# Altium project Adult_Main_Power_Unit.PrjPcb
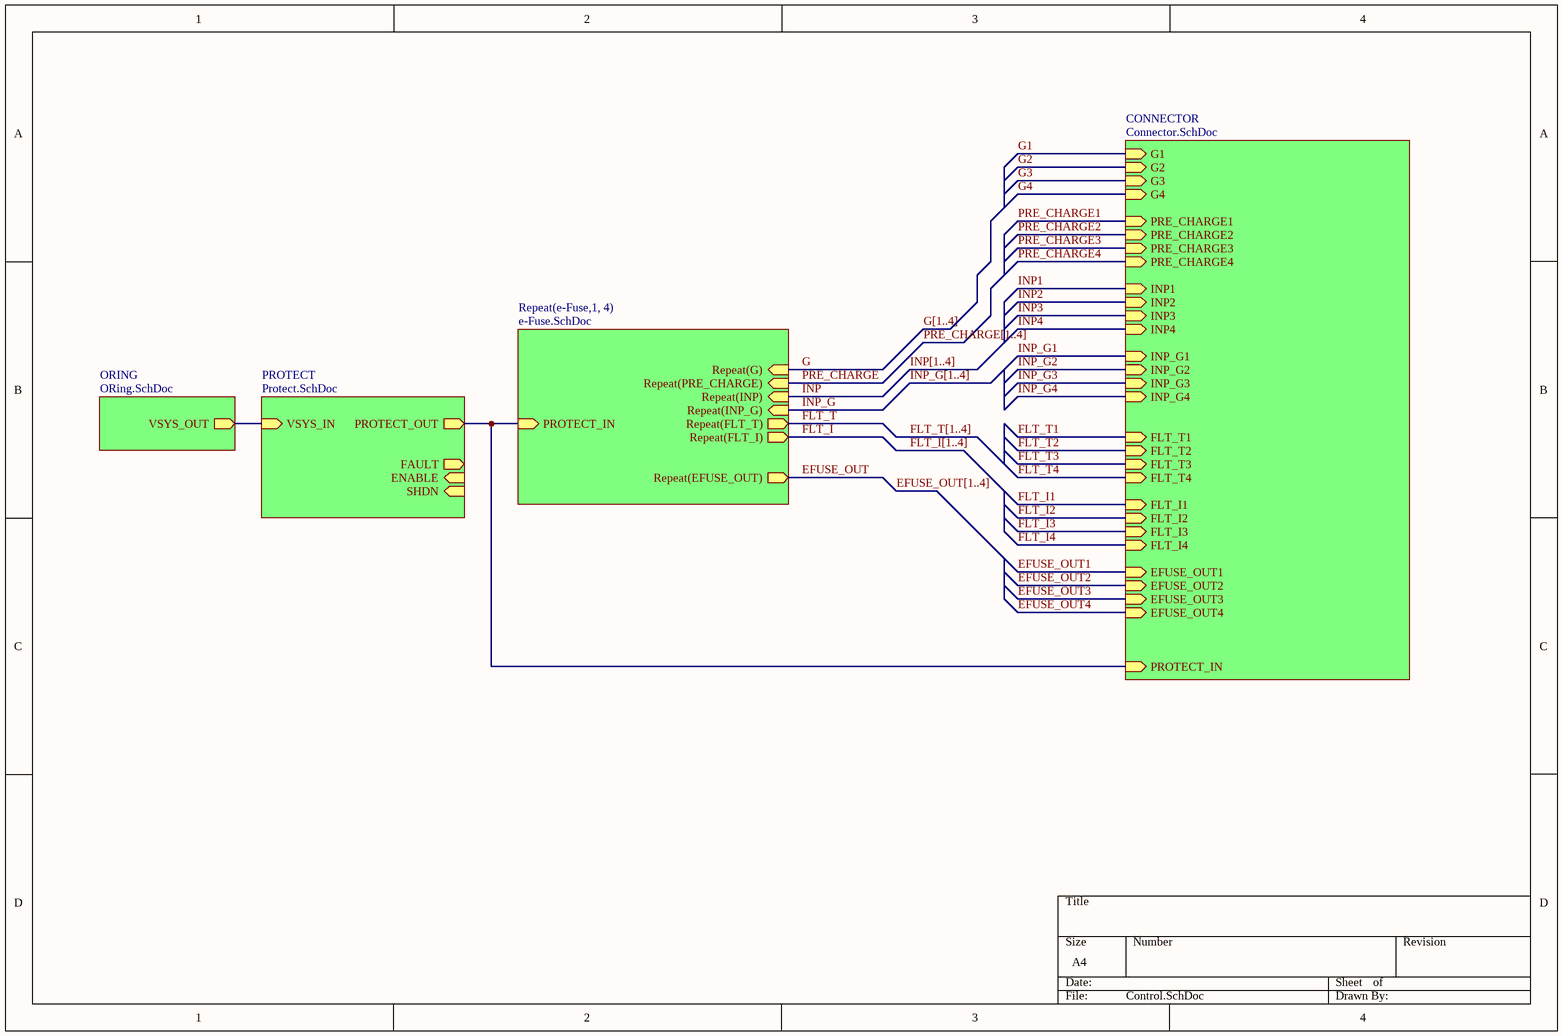
[diagram p0: Control.SchDoc]
5 sheets, 173 parts. Net scope: hierarchical (ports join the sheet entries above them; power ports are global).
Board file: Main_Power_Uint_1st.PcbDoc
Sheets:
  Control.SchDoc
    PROTECT = Protect.SchDoc
    e-Fuse1 = e-Fuse.SchDoc
    e-Fuse2 = e-Fuse.SchDoc
    e-Fuse3 = e-Fuse.SchDoc
    e-Fuse4 = e-Fuse.SchDoc
    CONNECTOR = Connector.SchDoc
    ORING = ORing.SchDoc

## Sheet Control.SchDoc
size A4; SheetNumber: 1; SheetTotal: 5

### Sub-sheets
CONNECTOR = Connector.SchDoc: FLT_I4 (in), FLT_T4 (in), INP_G4 (in), INP4 (in), FLT_I3 (in), FLT_T3 (in), INP_G3 (in), INP3 (in), FLT_I2 (in), FLT_T2 (in), INP_G2 (in), INP2 (in), FLT_I1 (in), FLT_T1 (in), INP_G1 (in), INP1 (in), PROTECT_IN (in), EFUSE_OUT4 (in), EFUSE_OUT3 (in), EFUSE_OUT2 (in), EFUSE_OUT1 (in), PRE_CHARGE4 (in), G4 (in), G3 (in), PRE_CHARGE2 (in), G2 (in), PRE_CHARGE1 (in), G1 (in), PRE_CHARGE3 (in)
ORING = ORing.SchDoc: VSYS_OUT (out)
PROTECT = Protect.SchDoc: PROTECT_OUT (out), VSYS_IN (in), SHDN (in), ENABLE (in), FAULT (out)
Repeat(e-Fuse,1, 4) = e-Fuse.SchDoc: PROTECT_IN (in), Repeat(PRE_CHARGE) (in), Repeat(EFUSE_OUT) (out), Repeat(G) (in), Repeat(FLT_I) (out), Repeat(FLT_T) (out), Repeat(INP_G) (in), Repeat(INP) (in)

### Nets
OUT1: sheet PROTECT/VSYS_IN, sheet ORING/VSYS_OUT
EFUSE_OUT: sheet Repeat(e-Fuse,1, 4)/Repeat(EFUSE_OUT)
FLT_I: sheet Repeat(e-Fuse,1, 4)/Repeat(FLT_I)
FLT_T: sheet Repeat(e-Fuse,1, 4)/Repeat(FLT_T)
G: sheet Repeat(e-Fuse,1, 4)/Repeat(G)
I_SENSE_N: sheet PROTECT/PROTECT_OUT, sheet Repeat(e-Fuse,1, 4)/PROTECT_IN, sheet CONNECTOR/PROTECT_IN
INP: sheet Repeat(e-Fuse,1, 4)/Repeat(INP)
INP_G: sheet Repeat(e-Fuse,1, 4)/Repeat(INP_G)
PRE_CHARGE: sheet Repeat(e-Fuse,1, 4)/Repeat(PRE_CHARGE)

### Buses and harness runs
bus EFUSE_OUT[1..4]
bus FLT_I[1..4]
bus FLT_T[1..4]
bus G[1..4]
bus INP[1..4]
bus INP_G[1..4]
bus PRE_CHARGE[1..4]

## Sheet Protect.SchDoc
size A3; SheetNumber: 3; SheetTotal: 5
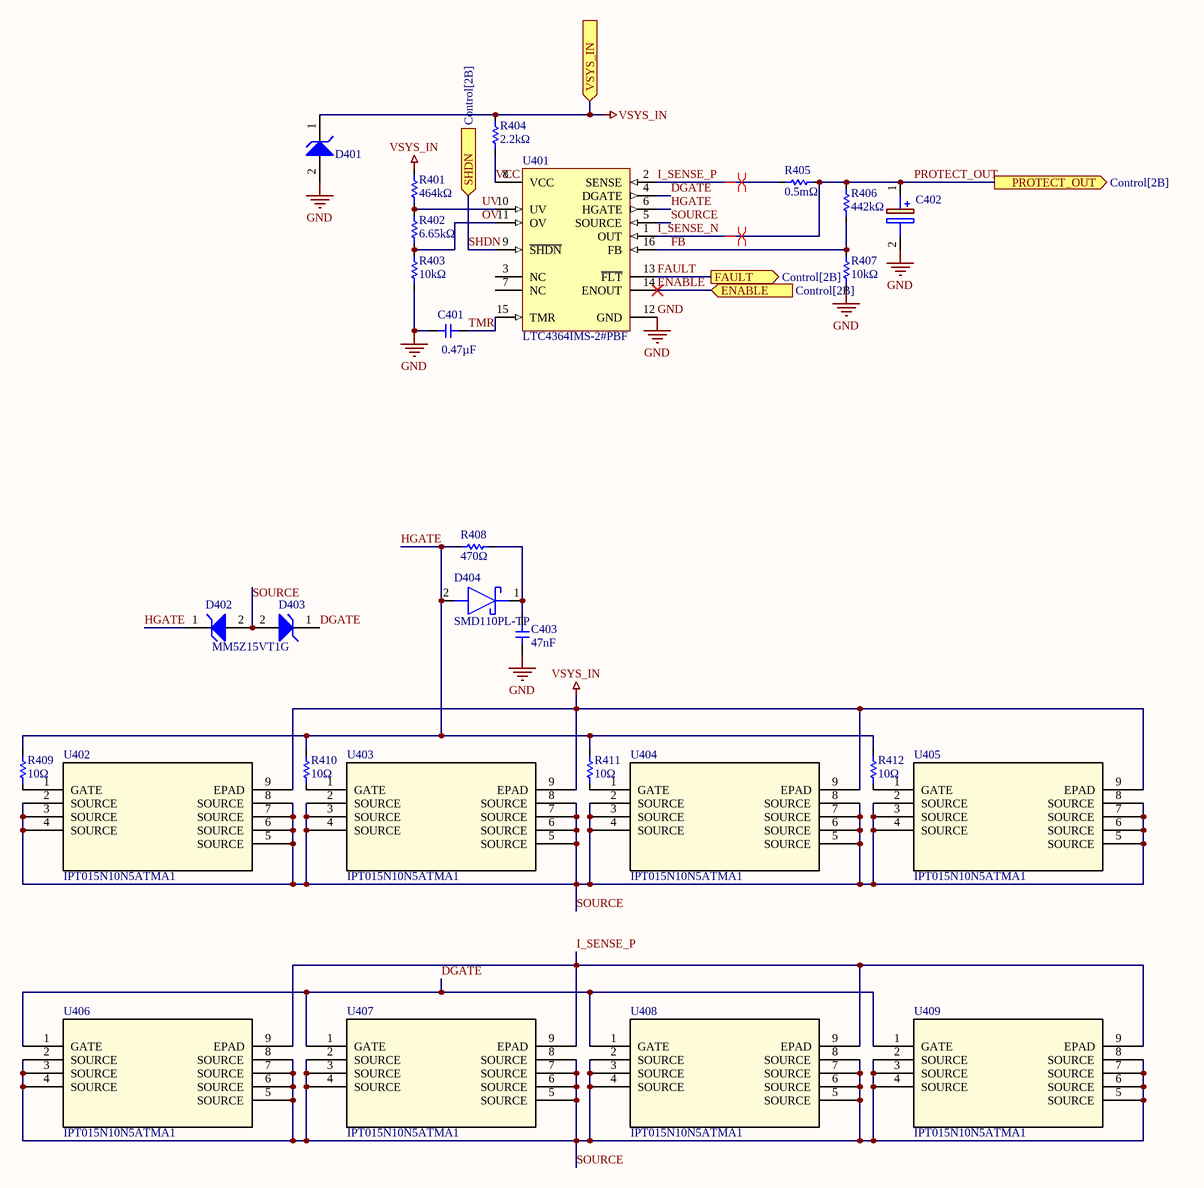
[diagram p1: Protect.SchDoc]

### Parts
C401  Capacitance: 0.47µF  [1210]  (hidden comment: non-polar_Capacitor)
C402  B41858C9477M000  [CAPPRD750W90D1800H3700]  (value not drawn)
C403  Capacitance: 47nF  [1210]  (hidden comment: non-polar_Capacitor)
D401  1SMB5945BT3G  [ONSC-SMB-2-403A-03_H_V]  (value not drawn)
D402  MM5Z15VT1G  [ONSC-SOD-523-2-502-01_V]
D403  MM5Z15VT1G  [ONSC-SOD-523-2-502-01_V]  (value not drawn)
D404  SMD110PL-TP  [SODFL3616X135N]
R401  464kΩ  [SMD_0603]
R402  6.65kΩ  [SMD_0603]
R403  10kΩ  [SMD_0603]
R404  2.2kΩ  [SMD_2512]
R405  0.5mΩ  [SMD_2512]
R406  442kΩ  [SMD_0603]
R407  10kΩ  [SMD_0603]
R408  470Ω  [SMD_0603]
R409  10Ω  [SMD_0603]
R410  10Ω  [SMD_0603]
R411  10Ω  [SMD_0603]
R412  10Ω  [SMD_0603]
U401  LTC4364IMS-2#PBF  [LT-MS-16_M]
U402  IPT015N10N5ATMA1  [PG-HSOF-8-1_INF]
U403  IPT015N10N5ATMA1  [PG-HSOF-8-1_INF]
U404  IPT015N10N5ATMA1  [PG-HSOF-8-1_INF]
U405  IPT015N10N5ATMA1  [PG-HSOF-8-1_INF]
U406  IPT015N10N5ATMA1  [PG-HSOF-8-1_INF]
U407  IPT015N10N5ATMA1  [PG-HSOF-8-1_INF]
U408  IPT015N10N5ATMA1  [PG-HSOF-8-1_INF]
U409  IPT015N10N5ATMA1  [PG-HSOF-8-1_INF]

### Ports
ENABLE (in, see Control[2B]), FAULT (out, see Control[2B]), PROTECT_OUT (out, see Control[2B]), SHDN (in, see Control[2B]), VSYS_IN (in, see Control[1B])

### Nets
GND: C401.1 C402.2(-) C403.1 D401.2(A) R403.2 R407.2 U401.12(GND)
VSYS_IN: D401.1(K) R401.1 R404.1 U402.9(EPAD) U403.9(EPAD) U404.9(EPAD) U405.9(EPAD) ; port VSYS_IN  [project net OUT1]
DGATE: D403.1(K) U401.4(DGATE) U406.1(GATE) U407.1(GATE) U408.1(GATE) U409.1(GATE)
ENABLE: U401.14(ENOUT) ; port ENABLE
FAULT: U401.13(~{FLT}) ; port FAULT
FB: R406.2 R407.1 U401.16(FB)
HGATE: D402.1(K) D404.2(A) R408.1 R409.1 R410.1 R411.1 R412.1 U401.6(HGATE)
I_SENSE_N: C402.1(+) R405.2 R406.1 U401.1(OUT) ; port PROTECT_OUT  [also labelled PROTECT_OUT]
I_SENSE_P: R405.1 U401.2(SENSE) U406.9(EPAD) U407.9(EPAD) U408.9(EPAD) U409.9(EPAD)
OV: R402.2 R403.1 U401.11(OV)
SHDN: U401.9(~{SHDN}) ; port SHDN
SOURCE: D402.2(A) D403.2(A) U401.5(SOURCE) U402.2(SOURCE) U402.3(SOURCE) U402.4(SOURCE) U402.5(SOURCE) U402.6(SOURCE) U402.7(SOURCE) U402.8(SOURCE) U403.2(SOURCE) U403.3(SOURCE) U403.4(SOURCE) U403.5(SOURCE) U403.6(SOURCE) U403.7(SOURCE) U403.8(SOURCE) U404.2(SOURCE) U404.3(SOURCE) U404.4(SOURCE) U404.5(SOURCE) U404.6(SOURCE) U404.7(SOURCE) U404.8(SOURCE) U405.2(SOURCE) U405.3(SOURCE) U405.4(SOURCE) U405.5(SOURCE) U405.6(SOURCE) U405.7(SOURCE) U405.8(SOURCE) U406.2(SOURCE) U406.3(SOURCE) U406.4(SOURCE) U406.5(SOURCE) U406.6(SOURCE) U406.7(SOURCE) U406.8(SOURCE) U407.2(SOURCE) U407.3(SOURCE) U407.4(SOURCE) U407.5(SOURCE) U407.6(SOURCE) U407.7(SOURCE) U407.8(SOURCE) U408.2(SOURCE) U408.3(SOURCE) U408.4(SOURCE) U408.5(SOURCE) U408.6(SOURCE) U408.7(SOURCE) U408.8(SOURCE) U409.2(SOURCE) U409.3(SOURCE) U409.4(SOURCE) U409.5(SOURCE) U409.6(SOURCE) U409.7(SOURCE) U409.8(SOURCE)
TMR: C401.2 U401.15(TMR)
UV: R401.2 R402.1 U401.10(UV)
VCC: R404.2 U401.8(VCC)
NetC403_2: C403.2 D404.1(K) R408.2
NetR409_2: R409.2 U402.1(GATE)
NetR410_2: R410.2 U403.1(GATE)
NetR411_2: R411.2 U404.1(GATE)
NetR412_2: R412.2 U405.1(GATE)

Not connected (* = marked no-connect by the designer): U401 3(NC) 7(NC)

### Layout directives
differential pair: I_SENSE_N, I_SENSE_P

### Library data of the parts
C401 C403 = CMP-024-000020-15: SMD type ceramic capacitor; Voltage: 50V; Design Item ID: Capacitor; Source: robit_passive.SchLib
C402 = B41858C9477M000: Capacitor Polarised; Manufacturer_Name: TDK; Datasheet Link: https://product.tdk.com/system/files/dam/doc/product/capacitor/aluminum-electrolytic/single-ended/data_sheet/20/30/db/aec/b41858.pdf; Height: 37mm; Manufacturer_Part_Number: B41858C9477M000; Mouser Part Number: 871-B41858C9477M; Mouser Price/Stock: https://www.mouser.co.uk/ProductDetail/EPCOS-TDK/B41858C9477M000?qs=nadT%2FcWsIvCTpIhXZMST%2FQ%3D%3D
D401 = CMP-1060-00175-1: 3 W Zener Voltage Regulator, 2-Pin SMB, Pb-Free, Tape and Reel; Manufacturer: On Semiconductor; VZ Typ (V): 68; ComponentLink3URL: http://www.onsemi.com/pub_link/Collateral/1SMB5913BT3-D.PDF; PackageReference: SMB-2-403A-03_H; PackageDescription: 2-Pin Small Molded Package, J-Bend Lead, Body 4.33 x 3.625 mm; PackageVersion: Rev. H, 05/2011; PartNumber: 1SMB5945BT3G; DatasheetVersion: Rev. 8; ComponentLink1Description: Manufacturer URL; ComponentLink1URL: http://www.onsemi.com/; RoHS: Pb-Free; ComponentLink2Description: Datasheet; Packing: Tape and Reel; ComponentLink2URL: http://www.onsemi.com/pub_link/Collateral/1SMB5913BT3-D.PDF; ComponentLink3Description: Package Specification; Mounting Technology: Surface Mount
D402 D403 = CMP-1060-00793-1: Zener Voltage Regulator, 500 mW, 2-Pin SOD-523, Pb-Free, Tape and Reel; Manufacturer: On Semiconductor; VZ Typ (V): 15; P Max (W): 0.5; PackageVersion: Rev. E, 09/2010; PartNumber: MM5Z15VT1G; ComponentLink2URL: http://www.onsemi.cn/pub_link/Collateral/MM5Z2V4T1-D.PDF; ComponentLink2Description: Datasheet; ComponentLink1Description: Manufacturer URL; PackageReference: SOD-523-2-502-01; ComponentLink3URL: http://www.onsemi.com/pub_link/Collateral/502-01.PDF; PackageDescription: 2-Pin SOD, Body 1.2 x 0.8 mm; ComponentLink3Description: Package Specification; RoHS: Pb-Free; ComponentLink1URL: http://www.onsemi.com/; Mounting Technology: Surface Mount; Packing: Tape and Reel; DatasheetVersion: Rev. 10
D404 = SMD110PL-TP: Schottky Diode; Manufacturer_Name: MCC; Datasheet Link: https://www.mccsemi.com/pdf/Products/SMD15PL-SMD1200PL(SOD-123FL).pdf; Height: 1.35mm; Manufacturer_Part_Number: SMD110PL-TP; Mouser Part Number: 833-SMD110PL-TP; Mouser Price/Stock: https://www.mouser.co.uk/ProductDetail/Micro-Commercial-Components-MCC/SMD110PL-TP?qs=xjxbgUsuSIBtRX%252BtbqnRwQ%3D%3D; Arrow Part Number: SMD110PL-TP; Arrow Price/Stock: https://www.arrow.com/en/products/smd110pl-tp/micro-commercial-components?utm_currency=USD&region=europe
R401-R407 R409-R412 = Resistor
R408 = Resistor: 0.1W, 0603
U401 = CMP-0474-00539-1: Surge Stopper with Ideal Diode, 4 to 80 V Vin, 16-pin SOP (MS-16), -40 to 85 degC, Pb-Free; Manufacturer: Linear Technology; Fast Comparator: no; Circuit Breaker Threshold: 50 mV; Circuit Breakers(#): 1; Active Limiting: yes; Vin Range: 4 to 80 V; Circuit Breaker Accuracy(%): 10; Extended Temp: C, I, H; ComponentLink1Description: Manufacturer URL; PackageReference: MS16; Mounting Technology: Surface Mount; RoHS: TRUE; PackageDescription: 16-Pin Plastic MSOP, Body 4.04 x 3.00 mm, Pitch 0.50 mm; ComponentLink3Description: Package Specification; PartNumber: LTC4364IMS-2#PBF; Power Good: no; ComponentLink2Description: Datasheet; ComponentLink2URL: http://cds.linear.com/docs/en/datasheet/436412f.pdf; ComponentLink1URL: http://www.linear.com/; ComponentLink3URL: http://cds.linear.com/docs/en/packaging/05081669_A_MS16.pdf; PackageVersion: Rev. Ã˜, 06/2010
U402-U409 = IPT015N10N5ATMA1: Infineonâ€™s OptiMOSâ„¢ power MOSFET in TO-Leadless package is optimized for high current applications up to 300 A, such as forklifts, light electric vehicles (LEV), power tools, point-of-loads (POL), telecom and e-fuses. Furthermore, the 60 percent smaller package size enables a very compact design. Compared to DÂ²PAK 7-pin, TO-Leadless shows a substantial reduction in footprint of 30 percent. The 50 percent reduced height offers a significant advantage in narrow applications such as rack or blade servers.; Copyright: Copyright (C) 2025 Ultra Librarian. All rights reserved.; Manufacturer_Name: Infineon; Manufacturer_Part_Number: IPT015N10N5ATMA1; RefDes: RefDes; Type: Type

## Sheet e-Fuse.SchDoc
size A3; SheetNumber: 4; SheetTotal: 5
Used 4 times, as channels e-Fuse1, e-Fuse2, e-Fuse3, e-Fuse4. Parts and nets are listed once, with the designators drawn on the sheet.
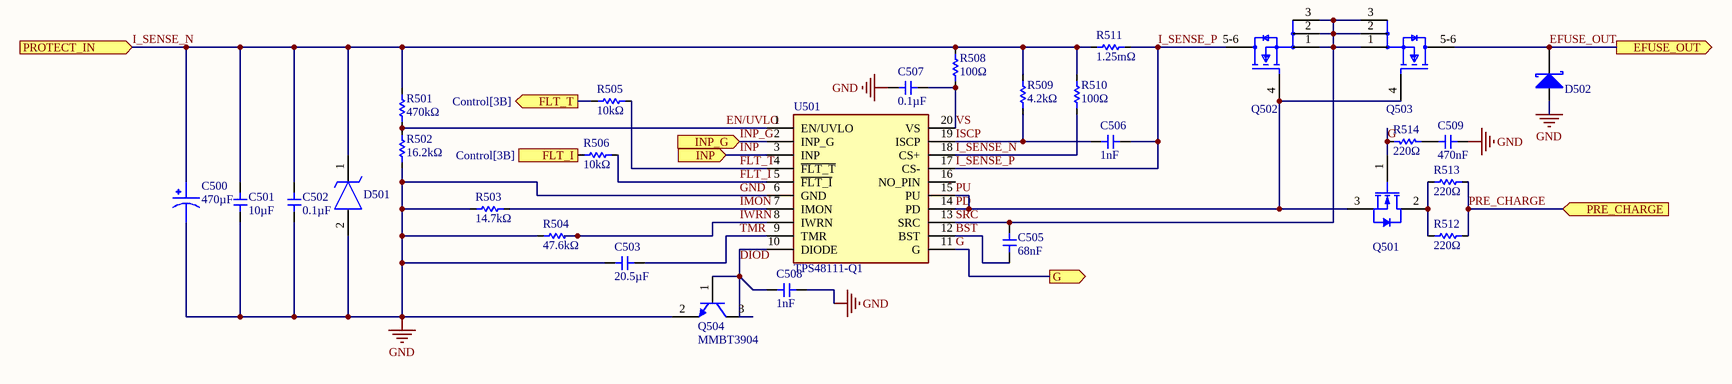
[diagram p2: e-Fuse.SchDoc]

### Parts
C500  470µF  [CAPAE1900X2200N]
C501  Capacitance: 10µF  [0603]  (hidden comment: CIN)
C502  Capacitance: 0.1µF  [0603]  (hidden comment: CIN)
C503  Capacitance: 20.5µF  [1210]  (hidden comment: C(TMR))
C505  Capacitance: 68nF  [0603]  (hidden comment: CBST)
C506  Capacitance: 1nF  [0603]  (hidden comment: C(SCP))
C507  Capacitance: 0.1µF  [0603]  (hidden comment: C(TMR))
C508  Capacitance: 1nF  [1210]  (hidden comment: C(TMR))
C509  Capacitance: 470nF  [0603]  (hidden comment: C(TMR))
D501  SMLJ58AQ-TP  [DIOM7959X282N]  (value not drawn)
D502  DFLS1100-7  [DIOD-POWERDI123-2_V]  (value not drawn)
Q501  IPD068N10N3 G  [INF-PG-TO252-3-11_A_L]  (value not drawn)
Q502  NVMFS015N10MCLT1G  [FP-488AA-MFG]  (value not drawn)
Q503  NVMFS015N10MCLT1G  [FP-488AA-MFG]  (value not drawn)
Q504  MMBT3904  [FAIR-SOT23-3_V]
R501  Resistance: 470kΩ  [0603]  (hidden comment: R1)
R502  Resistance: 16.2kΩ  [0603]  (hidden comment: R2)
R503  Resistance: 14.7kΩ  [0603]  (hidden comment: R(IMON))
R504  Resistance: 47.6kΩ  [0603]  (hidden comment: R(IWRN))
R505  Resistance: 10kΩ  [0603]  (hidden comment: R1)
R506  Resistance: 10kΩ  [0603]  (hidden comment: R1)
R508  Resistance: 100Ω  [0603]  (hidden comment: R(ISCP))
R509  Resistance: 4.2kΩ  [0603]  (hidden comment: R(ISCP))
R510  Resistance: 100Ω  [0603]  (hidden comment: R(SET))
R511  1.25mΩ  [SMD_2512]
R512  220Ω  [SMD_2512]
R513  220Ω  [SMD_2512]
R514  220Ω  [SMD_0603]
U501  TPS48111-Q1  [SOP50P490X110-20N]

### Ports
EFUSE_OUT (out, see Control[3B]), FLT_I (out, see Control[3B]), FLT_T (out, see Control[3B]), G (out, see Control[3B]), INP (in, see Control[3B]), INP_G (in, see Control[3B]), PRE_CHARGE (in, see Control[3B]), PROTECT_IN (in, see Control[2B], Connector[3B])

### Nets
GND: C500.2 C501.1 C502.1 C503.1 C507.1 C508.2 C509.2 D501.2(A) D502.1(A) Q504.2(E) R502.1 R503.1 R504.1 U501.6(GND)
BST: C505.1 U501.12(BST)
DIOD: C508.1 Q504.1(B) Q504.3(C) U501.10(DIODE)
EFUSE_OUT: D502.2(K) Q503.5-6(D) ; port EFUSE_OUT
EN/UVLO: R501.1 R502.2 U501.1(EN/UVLO)
FLT_I: R506.2 U501.5(~{FLT_I})
FLT_I: R506.1 ; port FLT_I  [a separate net that carries the same name]
FLT_T: R505.2 U501.4(~{FLT_T})
FLT_T: R505.1 ; port FLT_T  [a separate net that carries the same name]
G: Q501.1(GATE) R514.2 U501.11(G) ; port G
I_SENSE_N: C500.1 C501.2 C502.2 D501.1(K) R501.2 R508.2 R509.2 R510.1 R510.2 R511.2 U501.18(CS+) ; port PROTECT_IN
I_SENSE_P: C506.1 Q502.5-6(D) R511.1 U501.17(CS-)
IMON: R503.2 U501.7(IMON)
INP: U501.3(INP) ; port INP
INP_G: U501.2(INP_G) ; port INP_G
ISCP: C506.2 R509.1 U501.19(ISCP)
IWRN: R504.2 U501.8(IWRN)
PD: Q501.3(SOURCE) Q502.4(G) Q503.4(G) U501.14(PD) U501.15(PU)  [also labelled PU]
PRE_CHARGE: R512.2 R513.2 ; port PRE_CHARGE
SRC: C505.2 Q502.1(S) Q502.2(S) Q502.3(S) Q503.1(S) Q503.2(S) Q503.3(S) U501.13(SRC)
TMR: C503.2 U501.9(TMR)
VS: C507.2 R508.1 U501.20(VS)
NetC509_1: C509.1 R514.1
NetQ501_2: Q501.2(DRAIN) R512.1 R513.1

Not connected (* = marked no-connect by the designer): U501 16(NO_PIN)

### Channels
e-Fuse1: designators end in _1; ports EFUSE_OUT=EFUSE_OUT FLT_I=FLT_I1 FLT_T=FLT_T1 G=G INP=INP INP_G=INP_G PRE_CHARGE=PRE_CHARGE PROTECT_IN=I_SENSE_N
e-Fuse2: designators end in _2; ports EFUSE_OUT=EFUSE_OUT FLT_I=FLT_I2 FLT_T=FLT_T2 G=G INP=INP INP_G=INP_G PRE_CHARGE=PRE_CHARGE PROTECT_IN=I_SENSE_N
e-Fuse3: designators end in _3; ports EFUSE_OUT=EFUSE_OUT FLT_I=FLT_I3 FLT_T=FLT_T3 G=G INP=INP INP_G=INP_G PRE_CHARGE=PRE_CHARGE PROTECT_IN=I_SENSE_N
e-Fuse4: designators end in _4; ports EFUSE_OUT=EFUSE_OUT FLT_I=FLT_I4 FLT_T=FLT_T4 G=G INP=INP INP_G=INP_G PRE_CHARGE=PRE_CHARGE PROTECT_IN=I_SENSE_N

### Library data of the parts
C500 = MAL215099913E3: Cap Aluminum Lytic 470uF 100V 20% (18 X 21mm) SMD 1450mA 5000h 105Â°C Automotive AEC-Q200 T/R; MF: Vishay Beyschlag/Draloric; SnapEDA_Link: https://www.snapeda.com/parts/MAL215099913E3/Vishay/view-part/?ref=snap; Package: None; Value: *; MP: MAL215099913E3; Check_prices: https://www.snapeda.com/parts/MAL215099913E3/Vishay/view-part/?ref=eda
C501-C503 C505-C509 = CMP-024-000020-15: SMD type ceramic capacitor; Voltage: 50V; Design Item ID: Capacitor; Source: robit_passive.SchLib
D501 = SMLJ58AQ-TP: TVS Diode (Uni-directional); Manufacturer_Name: MCC; Datasheet Link: https://www.mccsemi.com/pdf/Products/SMLJ5.0AQ_SMLJ85CAQ(SMC).pdf; Height: 2.823mm; Manufacturer_Part_Number: SMLJ58AQ-TP
D502 = CMP-2000-05099-1: 1 A High Voltage Schottky Barrier Rectifier, 0.62 V, -55 to 175 degC, 2- Pin POWERDI123, Pb-Free, Tape and Reel; Manufacturer: Diodes Inc; Average Rectified Current-Max: 1A; Peak Current-Max: 40A; Forward Voltage: 0.77V; Reverse Current-Max: 1µA; Reverse Voltage-Max [Vrrm]: 100V; Datasheet Version: Sep-14; Datasheet URL: https://datasheet.ciiva.com/15144/getdatasheetpartid-44146-15144126.pdf; Manufacturer URL: http://www.diodes.com/
Q501 = CMP-1091-00169-1: N-Channel OptiMOS 3 Power-Transistor, 100 V VDS, 90 A ID, -55 to 175 degC, PG-TO252-3-11, Reel, Green; Manufacturer: Infineon; QG: 51Â nC; RDS (on) (max): 6.8Â mOhm; RthJC (max): 1 K/W; VGS(th) (min): 2Â V; RthJA (max): 62 K/W; VDS (max): 100Â V; ID (max): 90Â A; Ptot (max): 150Â W; Green: TRUE; Polarity: N; VGS(th) (max): 3.5Â V; Rth: 1Â K/W; IDpuls (max): 360Â A; Packing: Reel; ComponentLink1Description: Manufacturer URL; Mounting Technology: Surface Mount; ComponentLink2Description: Datasheet; PartNumber: IPD068N10N3 G; ComponentLink2URL: http://www.infineon.com/dgdl/IPD068N10N3+G_Rev2.1.pdf?folderId=db3a304313b8b5a60113cee8763b02d7&fileId=db3a30431ce5fb52011d1eb7aeb615d1; DatasheetVersion: Rev. 2.1; ComponentLink3URL: http://www.infineon.com/dgdl/IPD160N04L_rev1.0.pdf?folderId=db3a3043163797a6011643468e7505a4&fileId=db3a3043163797a60116436401cf05cf; PackageReference: PG-TO252-3-11; PackageVersion: Rev. 02, 03/2007; ComponentLink1URL: http://www.infineon.com/; PackageDescription: 3-Pin Plastic (Green) Transistor Single Outline Package, 6.57 x 6.1 mm Body, 2.29 mm Pitch; ComponentLink3Description: Package Specification
Q502 Q503 = CMP-00278-108017151-1: NVMFS015N10MCLT1G Mosfet, N-Ch, 100V, 47.1A, Dfn Rohs Compliant: Yes; Manufacturer Lifecycle Status: ACTIVE; Lifecycle Status: Production; NexarPartId: 108017151
Q504 = CMP-1670-00008-1: NPN General Purpose Amplifier, 40 V, 0.2 A, -55 to 150 degC, 3-Pin SOT23, RoHS, Tape and Reel; Tolerance: 30ppm; Capacitance: 1.8E-11 f; Frequency: 12.288 MHz; ESR: 40 Ohm; Load Capacitance: 18 pF; REACH SVHC: No SVHC; Pins: 4; ComponentLink3URL: http://www.fairchildsemi.com/dwg/MA/MA03D.pdf; PackageDescription: 3-Pin Small Outline Transistor, Body 2.92 x 1.325 mm, Pitch 0.95 mm; ComponentLink1URL: https://www.fairchildsemi.com/; Max Operating Temperature: 70degC; PackageReference: SOT23-3; ComponentLink1Description: Manufacturer URL; Width: 0.126 inch; Min Operating Temperature: -20degC; DatasheetVersion: Rev. 1.1.0, 10/2014; Mount: Surface Mount; Height: 0.041 inch; Package Quantity: 1000; Frequency Tolerance: 30ppm; Packaging: Tape and Reel; ComponentLink2URL: https://www.fairchildsemi.com/datasheets/MM/MMBT3904.pdf; RoHSCompliant: True; ComponentLink3Description: Package Specification; ComponentLink2Description: Datasheet; Length: 0.197 inch
R501-R506 R508-R510 = CMP-029-000004-8: SMD type resistor; Design Item ID: Resistor; Source: robit_passive.SchLib
R511 = Resistor: R(SNS)
R512-R514 = Resistor
U501 = TPS48111-Q1: Integrated Circuit; Manufacturer_Name: Texas Instruments; Datasheet Link: https://www.ti.com/lit/ds/slusee5c/slusee5c.pdf; Height: 1.1mm; Manufacturer_Part_Number: TPS48111-Q1

## Sheet Connector.SchDoc
size A4; SheetNumber: 5; SheetTotal: 5
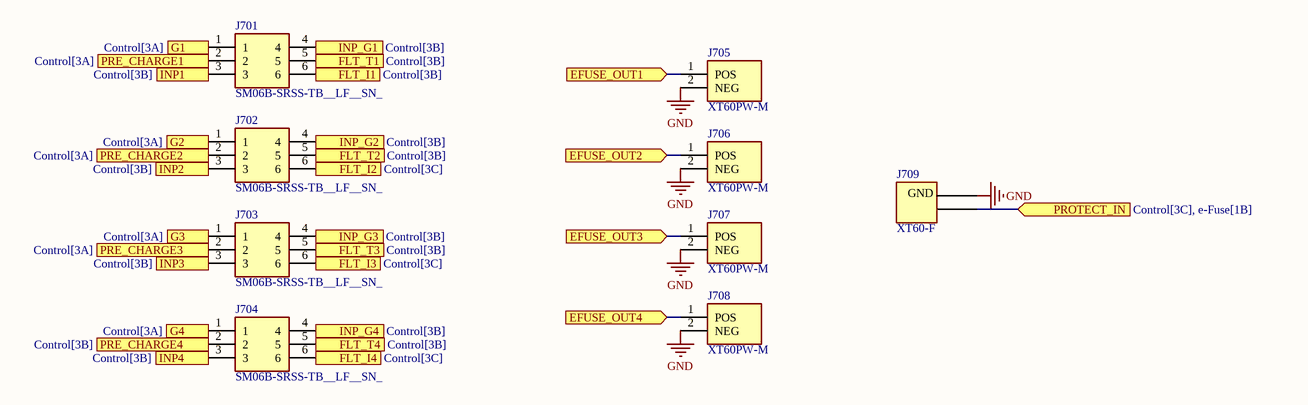
[diagram p3: Connector.SchDoc]

### Parts
J701  SM06B-SRSS-TB__LF__SN_  [SM06B-SRSS-TB]
J702  SM06B-SRSS-TB__LF__SN_  [SM06B-SRSS-TB]
J703  SM06B-SRSS-TB__LF__SN_  [SM06B-SRSS-TB]
J704  SM06B-SRSS-TB__LF__SN_  [SM06B-SRSS-TB]
J705  XT60PW-M  [XT60PW-M]
J706  XT60PW-M  [XT60PW-M]
J707  XT60PW-M  [XT60PW-M]
J708  XT60PW-M  [XT60PW-M]
J709  XT60-F  [XT60_F]

### Ports
EFUSE_OUT1 (in, see Control[3C]), EFUSE_OUT2 (in, see Control[3C]), EFUSE_OUT3 (in, see Control[3C]), EFUSE_OUT4 (in, see Control[3C]), FLT_I1 (out, see Control[3B]), FLT_I2 (out, see Control[3C]), FLT_I3 (out, see Control[3C]), FLT_I4 (out, see Control[3C]), FLT_T1 (out, see Control[3B]), FLT_T2 (out, see Control[3B]), FLT_T3 (out, see Control[3B]), FLT_T4 (out, see Control[3B]), G1 (in, see Control[3A]), G2 (in, see Control[3A]), G3 (in, see Control[3A]), G4 (in, see Control[3A]), INP1 (in, see Control[3B]), INP2 (in, see Control[3B]), INP3 (in, see Control[3B]), INP4 (in, see Control[3B]), INP_G1 (in, see Control[3B]), INP_G2 (in, see Control[3B]), INP_G3 (in, see Control[3B]), INP_G4 (in, see Control[3B]), PRE_CHARGE1 (in, see Control[3A]), PRE_CHARGE2 (in, see Control[3A]), PRE_CHARGE3 (in, see Control[3A]), PRE_CHARGE4 (in, see Control[3B]), PROTECT_IN (in, see Control[3C], e-Fuse[1B])

### Nets
GND: J705.2(NEG) J706.2(NEG) J707.2(NEG) J708.2(NEG) J709.1
EFUSE_OUT: J705.1(POS) ; port EFUSE_OUT1
EFUSE_OUT: J706.1(POS) ; port EFUSE_OUT2  [a separate net that carries the same name]
EFUSE_OUT: J707.1(POS) ; port EFUSE_OUT3  [a separate net that carries the same name]
EFUSE_OUT: J708.1(POS) ; port EFUSE_OUT4  [a separate net that carries the same name]
FLT_I1: J701.6 ; port FLT_I1
FLT_I2: J702.6 ; port FLT_I2
FLT_I3: J703.6 ; port FLT_I3
FLT_I4: J704.6 ; port FLT_I4
FLT_T1: J701.5 ; port FLT_T1
FLT_T2: J702.5 ; port FLT_T2
FLT_T3: J703.5 ; port FLT_T3
FLT_T4: J704.5 ; port FLT_T4
G: J701.1 ; port G1
G: J702.1 ; port G2  [a separate net that carries the same name]
G: J703.1 ; port G3  [a separate net that carries the same name]
G: J704.1 ; port G4  [a separate net that carries the same name]
I_SENSE_N: J709.2 ; port PROTECT_IN
INP: J701.3 ; port INP1
INP: J702.3 ; port INP2  [a separate net that carries the same name]
INP: J703.3 ; port INP3  [a separate net that carries the same name]
INP: J704.3 ; port INP4  [a separate net that carries the same name]
INP_G: J701.4 ; port INP_G1
INP_G: J702.4 ; port INP_G2  [a separate net that carries the same name]
INP_G: J703.4 ; port INP_G3  [a separate net that carries the same name]
INP_G: J704.4 ; port INP_G4  [a separate net that carries the same name]
PRE_CHARGE: J701.2 ; port PRE_CHARGE1
PRE_CHARGE: J702.2 ; port PRE_CHARGE2  [a separate net that carries the same name]
PRE_CHARGE: J703.2 ; port PRE_CHARGE3  [a separate net that carries the same name]
PRE_CHARGE: J704.2 ; port PRE_CHARGE4  [a separate net that carries the same name]

### Notes on the sheet
- (in symbol CMP-019-000061-2) GND

### Library data of the parts
J701-J704 = SM06B-SRSS-TB__LF__SN_: Connector; Manufacturer_Name: JST (JAPAN SOLDERLESS TERMINALS); Manufacturer_Part_Number: SM06B-SRSS-TB (LF)(SN); Datasheet Link: http://uk.rs-online.com/web/p/products/5468827
J705-J708 = CMP-019-000059-3: Socket, DC supply, male, PIN: 2; MF: AMASS; System: Connector; Package: Package; SnapEDA_Link: https://www.snapeda.com/parts/XT60PW-M/AMASS/view-part/?ref=snap; Design Item ID: XT60PW-M; Check_prices: https://www.snapeda.com/parts/XT60PW-M/AMASS/view-part/?ref=eda; MP: XT60PW-M; Price: None; Availability: Not in stock; Source: robit_connector.SchLib; Value: *
J709 = CMP-019-000061-2: XT60 connector; System: Connector

## Sheet ORing.SchDoc
size A4; SheetNumber: 2; SheetTotal: 5
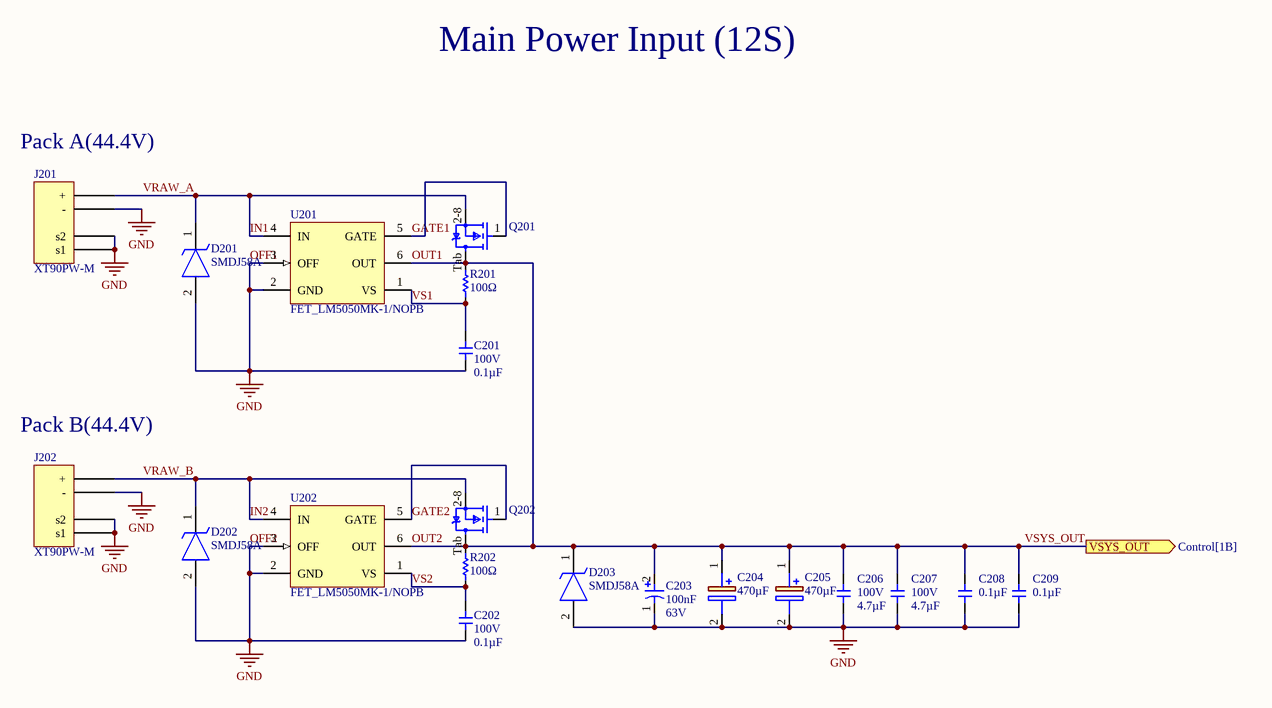
[diagram p4: ORing.SchDoc]

### Parts
C201  Voltage: 100V  Capacitance: 0.1µF  [1206]  (hidden comment: non-polar_Capacitor)
C202  Voltage: 100V  Capacitance: 0.1µF  [1206]  (hidden comment: non-polar_Capacitor)
C203  Capacitance: 100nF  Voltage: 63V  [SMD_Capacitor_tantal]  (hidden comment: Capacitor_tantal)
C204  470µF  [CAPAE1900X2200N]
C205  470µF  [CAPAE1900X2200N]
C206  Voltage: 100V  Capacitance: 4.7µF  [1210]  (hidden comment: non-polar_Capacitor)
C207  Voltage: 100V  Capacitance: 4.7µF  [1210]  (hidden comment: non-polar_Capacitor)
C208  Capacitance: 0.1µF  [0603]  (hidden comment: non-polar_Capacitor)
C209  Capacitance: 0.1µF  [0603]  (hidden comment: non-polar_Capacitor)
D201  SMDJ58A  [DIONM7959X262N]
D202  SMDJ58A  [DIONM7959X262N]
D203  SMDJ58A  [DIONM7959X262N]
J201  XT90PW-M  [AMASS_XT90PW-M]
J202  XT90PW-M  [AMASS_XT90PW-M]
Q201  Trans_Infineon_IPT015N10N5_eec  [Infineon_IPT015N10N5_0]  (value not drawn)
Q202  Trans_Infineon_IPT015N10N5_eec  [Infineon_IPT015N10N5_0]  (value not drawn)
R201  Resistance: 100Ω  [0603]  (hidden comment: Resistor)
R202  Resistance: 100Ω  [0603]  (hidden comment: Resistor)
U201  FET_LM5050MK-1/NOPB  [DDC0006A_M]
U202  FET_LM5050MK-1/NOPB  [DDC0006A_M]

### Ports
VSYS_OUT (out, see Control[1B])

### Nets
GND: C201.1 C202.1 C203.1 C204.2(-) C205.2(-) C206.2 C207.1 C208.1 C209.1 D201.2(A) D202.2(A) D203.2(A) J201.N(-) J201.S1(s1) J201.S2(s2) J202.N(-) J202.S1(s1) J202.S2(s2) U201.2(GND) U201.3(OFF) U202.2(GND) U202.3(OFF)  [also labelled OFF1, OFF2]
OUT1: C203.2 C204.1(+) C205.1(+) C206.1 C207.2 C208.2 C209.2 D203.1(K) Q201.Tab(Drain) Q202.Tab(Drain) R201.2 R202.2 U201.6(OUT) U202.6(OUT) ; port VSYS_OUT  [also labelled OUT2, VSYS_OUT]
GATE1: Q201.1(Gate) U201.5(GATE)
GATE2: Q202.1(Gate) U202.5(GATE)
IN1: D201.1(K) J201.P(+) Q201.2-8(Source) U201.4(IN)  [also labelled VRAW_A]
IN2: D202.1(K) J202.P(+) Q202.2-8(Source) U202.4(IN)  [also labelled VRAW_B]
VS1: C201.2 R201.1 U201.1(VS)
VS2: C202.2 R202.1 U202.1(VS)

### Notes on the sheet
- Main Power Input (12S)
- (near J201) Pack A(44.4V)
- (near J202) Pack B(44.4V)

### Library data of the parts
C201 C202 = CMP-024-000020-15: SMD type ceramic capacitor; Design Item ID: Capacitor; Source: robit_passive.SchLib
C203 = CMP-024-000021-5: SMD type tantalum capacitor; Design Item ID: Capacitor_tantal; Source: robit_passive.SchLib
C204 C205 = MAL215099913E3: Capacitor Polarised; Manufacturer_Name: Vishay; Datasheet Link: https://www.vishay.com/docs/28395/150crz.pdf; Height: 22mm; Manufacturer_Part_Number: MAL215099913E3; Mouser Part Number: 594-MAL215099913E3; Mouser Price/Stock: https://www.mouser.co.uk/ProductDetail/Vishay-BC-Components/MAL215099913E3?qs=bKenfurwlsm0xND%252Ba3hAeg%3D%3D; Arrow Part Number: MAL215099913E3; Arrow Price/Stock: null?region=nac
C206 C207 = CMP-024-000020-16: SMD type ceramic capacitor; Source: robit_passive.SchLib; Design Item ID: Capacitor
C208 C209 = CMP-024-000020-16: SMD type ceramic capacitor; Voltage: 100V; Source: robit_passive.SchLib; Design Item ID: Capacitor
D201-D203 = SMDJ58A: TVS Diode (Uni-directional); Manufacturer_Name: LITTELFUSE; Datasheet Link: https://mouser.componentsearchengine.com/Datasheets/2/SMDJ58A.pdf; Height: 2.62mm; Manufacturer_Part_Number: SMDJ58A; Mouser Part Number: 576-SMDJ58A; Mouser Price/Stock: https://www.mouser.co.uk/ProductDetail/Littelfuse/SMDJ58A?qs=zL8PTTxXkF2zAaoXCy3ytQ%3D%3D; Arrow Part Number: SMDJ58A; Arrow Price/Stock: https://www.arrow.com/en/products/smdj58a/littelfuse?utm_currency=USD&region=nac
J201 J202 = CMP-019-000092-5: Socket; DC supply; XT90; male; PIN: 2; on PCBs; THT; Colour: yellow; MF: AMASS; System: Connector; SnapEDA_Link: https://www.snapeda.com/parts/XT90PW-M/AMASS/view-part/?ref=snap; Package: Package; Source: XT90PW-M.SchLib; Check_prices: https://www.snapeda.com/parts/XT90PW-M/AMASS/view-part/?ref=eda; Value: *; Design Item ID: XT90PW-M; Pin Count: 2; MP: XT90PW-M; Component Type: Standard
Q201 Q202 = Trans_Infineon_IPT015N10N5_eec: TRANS MOSFET N-CH 100V 300A 8HSOF; Part Number: IPT015N10N5; helpURL: https://upverter.com/upn/revision/59ddb1136ed40b7f/; ComponentLink2Description: Datasheet; Temperature: -55°C to +175°C; Package: HSOF8; Supplier 2: Mouser; Supplier 1: Digi-Key; ComponentLink1URL: https://upverter.com/upn/revision/59ddb1136ed40b7f/; Supplier Part Number 2: 726-IPT015N10N5ATMA1; Supplier Part Number 1: IPT015N10N5ATMA1CT-ND; Manufacturer: Infineon; ComponentLink1Description: Upverter; ComponentLink2URL: http://www.infineon.com/dgdl/Infineon-IPT015N10N5-DS-v02_02-EN.pdf?fileId=5546d4624a75e5f1014ac94680661aff; RoHS: TRUE; Mouser Part Number: 726-IPT015N10N5ATMA1; Temperature Range High: +175°C; Digikey Description: TRANS MOSFET N-CH 100V 300A 8HSOF; Digikey Part Number: IPT015N10N5ATMA1CT-ND; Lead Free: yes; Temperature Range Low: -55°C
R201 R202 = CMP-029-000004-8: SMD type resistor; Design Item ID: Resistor; Source: robit_passive.SchLib
U201 U202 = CMP-026-000034-1: 5-V to 75-V 400-uA IQ ORing FET controller 6-SOT-23-THIN -40 to 125

## Nets that join several sheets
GND: Protect (7 pins), e-Fuse1 (14 pins), e-Fuse2 (14 pins), e-Fuse3 (14 pins), e-Fuse4 (14 pins), Connector (5 pins), ORing (22 pins)
OUT1: Protect (7 pins), ORing (14 pins)
EFUSE_OUT: e-Fuse1 (D502_1.2 Q503_1.5-6), Connector (J705.1)
EFUSE_OUT: e-Fuse2 (D502_2.2 Q503_2.5-6), Connector (J706.1)
EFUSE_OUT: e-Fuse3 (D502_3.2 Q503_3.5-6), Connector (J707.1)
EFUSE_OUT: e-Fuse4 (D502_4.2 Q503_4.5-6), Connector (J708.1)
FLT_I1: e-Fuse1 (R506_1.1), Connector (J701.6)
FLT_I2: e-Fuse2 (R506_2.1), Connector (J702.6)
FLT_I3: e-Fuse3 (R506_3.1), Connector (J703.6)
FLT_I4: e-Fuse4 (R506_4.1), Connector (J704.6)
FLT_T1: e-Fuse1 (R505_1.1), Connector (J701.5)
FLT_T2: e-Fuse2 (R505_2.1), Connector (J702.5)
FLT_T3: e-Fuse3 (R505_3.1), Connector (J703.5)
FLT_T4: e-Fuse4 (R505_4.1), Connector (J704.5)
G: e-Fuse1 (Q501_1.1 R514_1.2 U501_1.11), Connector (J701.1)
G: e-Fuse2 (Q501_2.1 R514_2.2 U501_2.11), Connector (J702.1)
G: e-Fuse3 (Q501_3.1 R514_3.2 U501_3.11), Connector (J703.1)
G: e-Fuse4 (Q501_4.1 R514_4.2 U501_4.11), Connector (J704.1)
I_SENSE_N: Protect (C402.1 R405.2 R406.1 U401.1), e-Fuse1 (11 pins), e-Fuse2 (11 pins), e-Fuse3 (11 pins), e-Fuse4 (11 pins), Connector (J709.2)
INP: e-Fuse1 (U501_1.3), Connector (J701.3)
INP: e-Fuse2 (U501_2.3), Connector (J702.3)
INP: e-Fuse3 (U501_3.3), Connector (J703.3)
INP: e-Fuse4 (U501_4.3), Connector (J704.3)
INP_G: e-Fuse1 (U501_1.2), Connector (J701.4)
INP_G: e-Fuse2 (U501_2.2), Connector (J702.4)
INP_G: e-Fuse3 (U501_3.2), Connector (J703.4)
INP_G: e-Fuse4 (U501_4.2), Connector (J704.4)
PRE_CHARGE: e-Fuse1 (R512_1.2 R513_1.2), Connector (J701.2)
PRE_CHARGE: e-Fuse2 (R512_2.2 R513_2.2), Connector (J702.2)
PRE_CHARGE: e-Fuse3 (R512_3.2 R513_3.2), Connector (J703.2)
PRE_CHARGE: e-Fuse4 (R512_4.2 R513_4.2), Connector (J704.2)